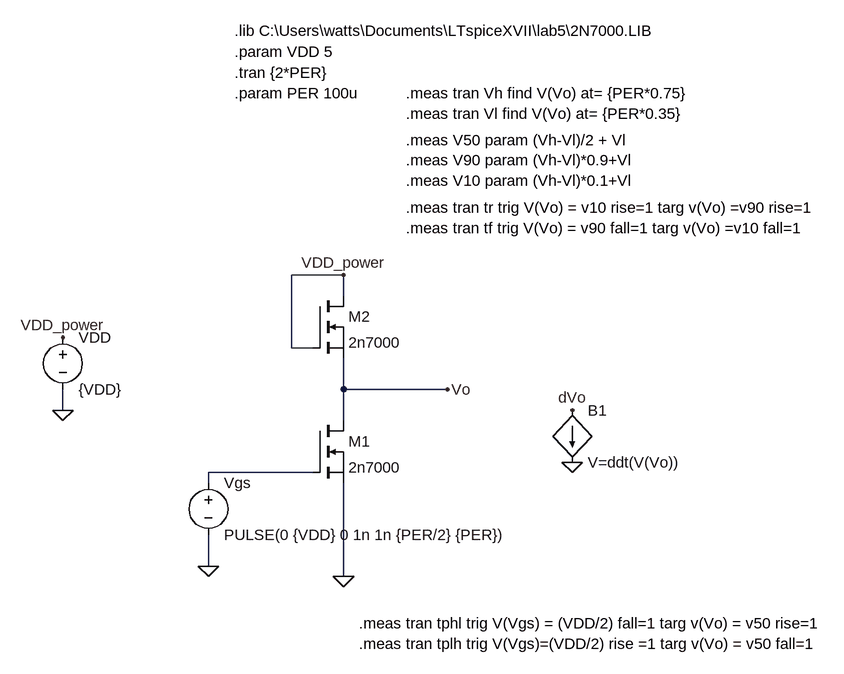
[diagram p0: schematic NMOS_saturated_load_logic.asc]
NMOS_saturated_load_logic.asc, the LTspice schematic file:
Version 4
SHEET 1 1100 680
WIRE 272 -128 192 -128
WIRE 272 -96 272 -128
WIRE 192 -16 192 -128
WIRE 224 -16 192 -16
WIRE 272 48 272 0
WIRE 432 48 272 48
WIRE -160 80 -160 48
WIRE 272 96 272 48
WIRE 224 176 64 176
WIRE 64 192 64 176
WIRE 64 320 64 272
WIRE 272 336 272 192
FLAG 64 320 0
FLAG -160 80 0
FLAG -160 -32 VDD_power
FLAG 272 -128 VDD_power
FLAG 432 48 Vo
FLAG 272 336 0
FLAG 624 160 0
FLAG 624 80 dVo
SYMBOL voltage 64 176 R0
WINDOW 123 0 0 Left 0
WINDOW 39 0 0 Left 0
SYMATTR InstName Vgs
SYMATTR Value PULSE(0 {VDD} 0 1n 1n {PER/2} {PER})
SYMBOL voltage -160 -48 R0
SYMATTR InstName VDD
SYMATTR Value {VDD}
SYMBOL nmos 224 96 R0
SYMATTR InstName M1
SYMATTR Value 2n7000
SYMATTR Prefix X
SYMBOL nmos 224 -96 R0
SYMATTR InstName M2
SYMATTR Value 2n7000
SYMATTR Prefix X
SYMBOL bi 624 80 R0
SYMATTR InstName B1
SYMATTR Value V=ddt(V(Vo))
TEXT 104 -504 Left 2 !.lib C:\\Users\\watts\\Documents\\LTspiceXVII\\lab5\\2N7000.LIB
TEXT 104 -472 Left 2 !.param VDD 5
TEXT 104 -440 Left 2 !.tran {2*PER}
TEXT 104 -408 Left 2 !.param PER 100u
TEXT 368 -408 Left 2 !.meas tran Vh find V(Vo) at= {PER*0.75}\n.meas tran Vl find V(Vo) at= {PER*0.35}
TEXT 368 -336 Left 2 !.meas V50 param (Vh-Vl)/2 + Vl\n.meas V90 param (Vh-Vl)*0.9+Vl\n.meas V10 param (Vh-Vl)*0.1+Vl
TEXT 368 -232 Left 2 !.meas tran tr trig V(Vo) = v10 rise=1 targ v(Vo) =v90 rise=1\n.meas tran tf trig V(Vo) = v90 fall=1 targ v(Vo) =v10 fall=1
TEXT 296 408 Left 2 !.meas tran tphl trig V(Vgs) = (VDD/2) fall=1 targ v(Vo) = v50 rise=1\n.meas tran tplh trig V(Vgs)=(VDD/2) rise =1 targ v(Vo) = v50 fall=1

The netlist it stands for:
* NMOS_saturated_load_logic.asc
Vgs N001 0 PULSE(0 {VDD} 0 1n 1n {PER/2} {PER})
VDD VDD_power 0 {VDD}
XM1 Vo N001 0 2n7000  ; pins D G S
XM2 VDD_power VDD_power Vo 2n7000  ; pins D G S
B1 dVo 0 V=ddt(V(Vo))
.lib C:\Users\watts\Documents\LTspiceXVII\lab5\2N7000.LIB
.param VDD 5
.tran {2*PER}
.param PER 100u
.meas tran Vh find V(Vo) at= {PER*0.75}
.meas tran Vl find V(Vo) at= {PER*0.35}
.meas V50 param (Vh-Vl)/2 + Vl
.meas V90 param (Vh-Vl)*0.9+Vl
.meas V10 param (Vh-Vl)*0.1+Vl
.meas tran tr trig V(Vo) = v10 rise=1 targ v(Vo) =v90 rise=1
.meas tran tf trig V(Vo) = v90 fall=1 targ v(Vo) =v10 fall=1
.meas tran tphl trig V(Vgs) = (VDD/2) fall=1 targ v(Vo) = v50 rise=1
.meas tran tplh trig V(Vgs)=(VDD/2) rise =1 targ v(Vo) = v50 fall=1
.backanno
.end